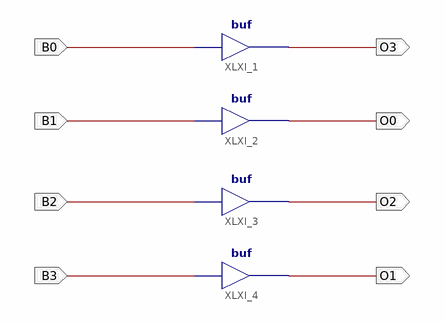
[diagram p0: schematic sheet 1]
// Xilinx ISE schematic P4.sch (xc9500xl) as structural Verilog: 4 symbols, 8 ports
module P4 (
  input  B0,
  input  B1,
  input  B2,
  input  B3,
  output O3,
  output O0,
  output O2,
  output O1
);

  buf XLXI_1 (O3, B0);
  buf XLXI_2 (O0, B1);
  buf XLXI_3 (O2, B2);
  buf XLXI_4 (O1, B3);
endmodule
